# EasyEDA Pro project CH32LoongsonEJTAG_v1.2.epro

# Schematic Schematic1
Board Name: Board1; Create Date: 2025-04-06; Page Name: P1; Project Name: CH32LoongsonEJTAG; Schematic Name: Schematic1; Update Date: 2025-05-27; Company: 嘉立创EDA; Page Size: A4; Version: V1.1
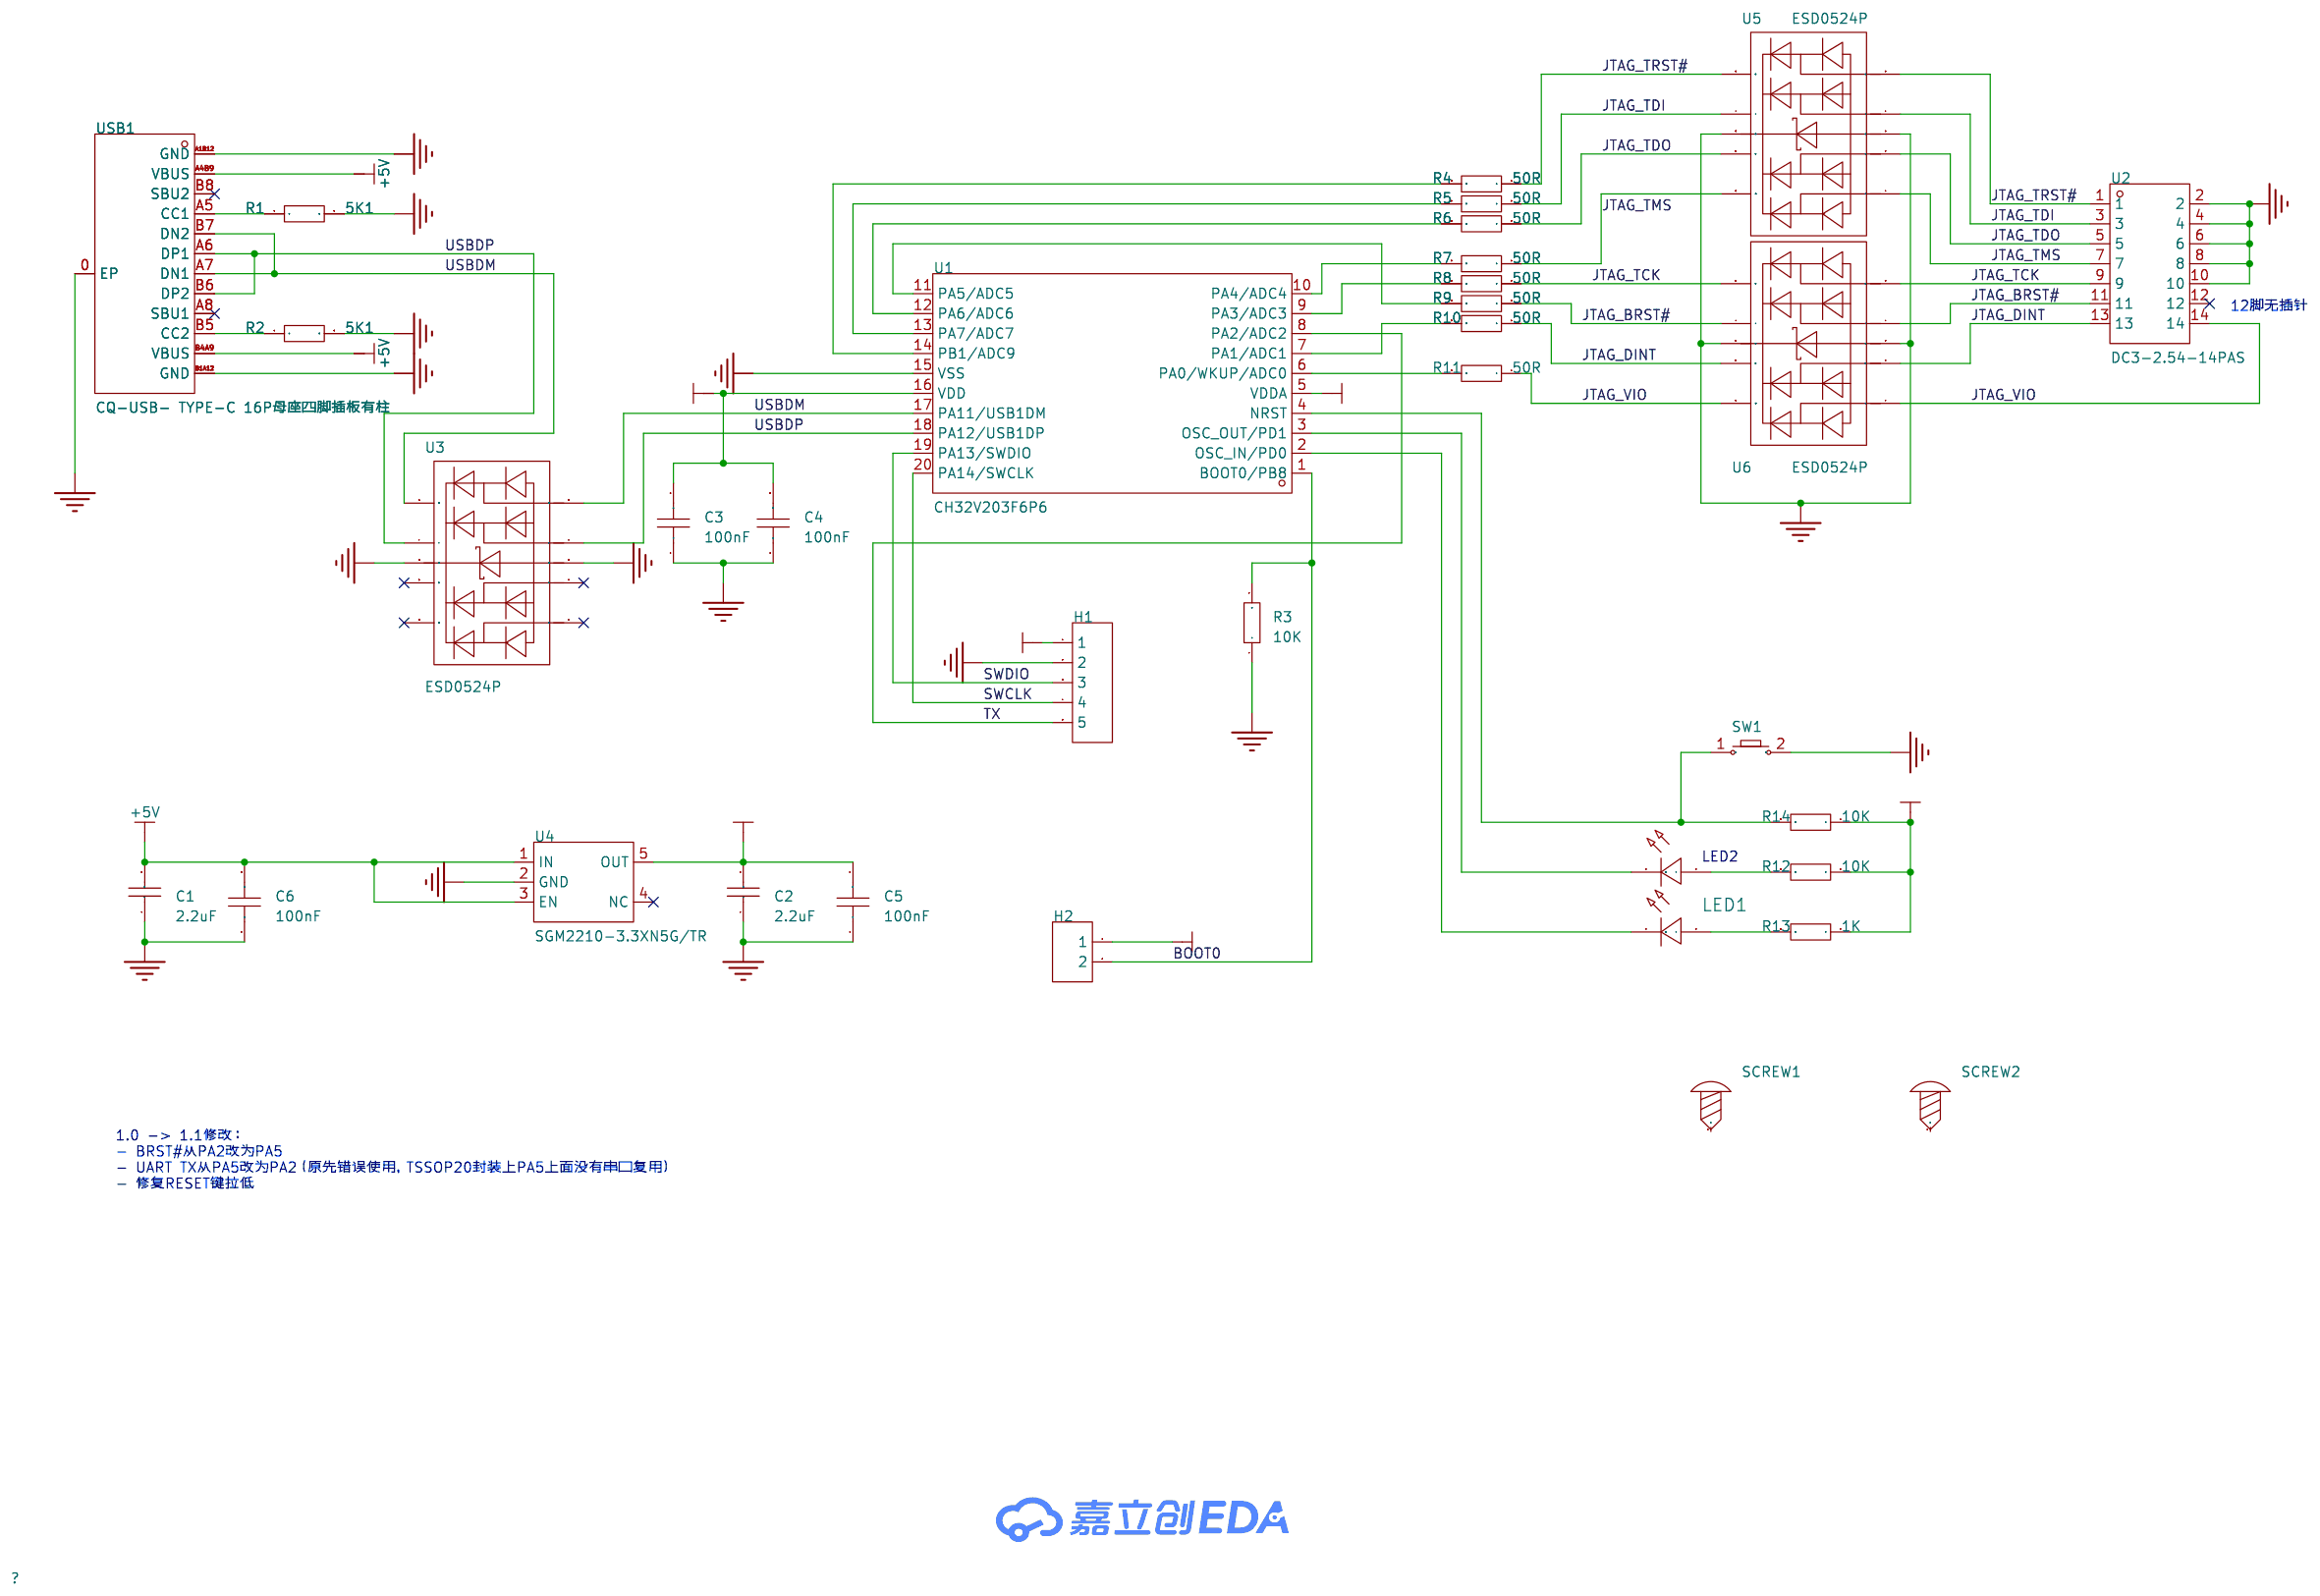
[diagram p0: schematic sheet]

## Parts
C1  2.2uF  [C0603]
C2  2.2uF  [C0603]
C3  100nF  [C0603]
C4  100nF  [C0603]
C5  100nF  [C0603]
C6  100nF  [C0603]
H1  -  [HDR-TH_5P-P2.54-V-F]
H2  -  [HDR-TH_2P-P2.54-V-F]
LED1  -  [LED_0603]
LED2  -  [LED_0603]
R1  5K1  [R0603]
R2  5K1  [R0603]
R3  10K  [R0603]
R4  50R  [R0603]
R5  50R  [R0603]
R6  50R  [R0603]
R7  50R  [R0603]
R8  50R  [R0603]
R9  50R  [R0603]
R10  50R  [R0603]
R11  50R  [R0603]
R12  10K  [R0603]
R13  1K  [R0603]
R14  10K  [R0603]
SCREW1  -  [M2螺丝]
SCREW2  -  [M2螺丝]
SW1  -  [Key_SMD_3x4x2]
U1  CH32V203F6P6  [TSSOP-20_L6.5-W4.4-P0.65-LS6.4-BL]
U2  DC3-2.54-14PAS  [IDC-TH_14P-P2.54_DC3-2.54-14PAS]
U3  ESD0524P  [DFN-10_L2.5-W1.0-P0.50-BL-A]
U4  SGM2210-3.3XN5G/TR  [SOT-23-5_L2.9-W1.6-P0.95-LS2.8-BL]
U5  ESD0524P  [DFN-10_L2.5-W1.0-P0.50-BL-A]
U6  ESD0524P  [DFN-10_L2.5-W1.0-P0.50-BL-A]
USB1  CQ-USB- TYPE-C 16P母座四脚插板有柱  [USB-C-SMD_CQ-USB-TYPE-C]

## Library data of the parts
C1 C2 = 0603B222K500NT: 容值:2.2nF;精度:±10%;额定电压:50V;温度系数:X7R;; LCSC Part Name: 2.2nF ±10% 50V; Supplier Part: C1604; Manufacturer: FH(风华); Supplier Footprint: 0603; JLCPCB Part Class: Basic Part; Datasheet: https://atta.szlcsc.com/upload/public/pdf/source/20200305/C486355_26A10D38EF8C2A5C37091D0039909270.pdf; Supplier: LCSC; Tolerance: ±10%; Voltage Rating: 50V; Temperature Coefficient: X7R
C3-C6 = CC0603KRX7R9BB104: 容值:100nF;精度:±10%;额定电压:50V;材质(温度系数):X7R;; LCSC Part Name: 100nF ±10% 50V; Supplier Part: C14663; Manufacturer: YAGEO(国巨); Supplier Footprint: 0603; JLCPCB Part Class: 基础库; Datasheet: https://atta.szlcsc.com/upload/public/pdf/source/20180910/C282072_33301C7F631E79921B82A8DAC6BCC5B3.pdf; Supplier: LCSC; Tolerance: ±10%; Voltage Rated: 50V; Temperature Coefficient: X7R
H1 = HDR-F_2.54_1x5P: Supplier Part: C50950; Supplier Footprint: 插件
H2 = HDR-F_2.54_1x2P: Supplier Part: C49661; Supplier Footprint: 插件
LED1 = LED_0603-R: Supplier Footprint: 0603
LED2 = LED_0603-G: Supplier Footprint: 0603
R1-R14 = Res_0603: Supplier Footprint: 0603
SCREW1 SCREW2 = M2螺丝: Supplier Footprint: 插件
SW1 = Key_SMD_3x4x2: Supplier Footprint: SMD
U1 = CH32V203F6P6: Supplier Part: C3040880; Manufacturer: WCH(南京沁恒); Supplier Footprint: TSSOP-20; JLCPCB Part Class: 扩展库; Datasheet: https://atta.szlcsc.com/upload/public/pdf/source/20230523/1B381532B53560847D0152FAE396CF1C.pdf; Supplier: LCSC
U2 = DC3-2.54-14PAS: 连接器类型:简牛座;间距:2.54mm;结构:2x7P;额定电流:1.5A;额定电压:-;封装形式:直插;行距:2.54mm;排数:2;每排PIN数:7;工作温度范围:-40℃~+105℃;; LCSC Part Name: 2.54mm 2x7P 排数:2 每排P数:7; Supplier Part: C2977595; Manufacturer: ZHOURI(洲日); Supplier Footprint: 插件,P=2.54mm; JLCPCB Part Class: 扩展库; Datasheet: https://atta.szlcsc.com/upload/public/pdf/source/20220328/8C4F9C608F6421C8730FC92148E2CB6E.pdf; Supplier: LCSC; Connector Type: 简牛座; Pitch: 2.54mm; Structure: 2x7P; Current Rating (Max): 1.5A; Holder Type: 直插; Row Spacing: 2.54mm; Number of Rows: 2; Pin Number in each Row: 7; Operating Temperature Range: -40℃~+105℃
U3 U5 U6 = ESD0524P_C5334573: 极性:单向;反向截止电压(Vrwm):5V;最大钳位电压:15V;峰值脉冲电流(Ipp)@10/1000us:2A;峰值脉冲功率(Ppp)@10/1000us:-;击穿电压:6V;; Supplier Part: C5334573; Manufacturer: SHIKUES(时科); Supplier Footprint: DFN2510; JLCPCB Part Class: 扩展库; Datasheet: https://atta.szlcsc.com/upload/public/pdf/source/20230209/B8924CF75EEDB5BA3DE32DF217AD14E8.pdf; Supplier: LCSC; polarity: 单向; Reverse Stand-Off Voltage (Vrwm): 5V; Maximum Clamping Voltage: 15V; Peak Pulse Current (Ipp)@10/1000us: 2A; Breakdown Voltage: 6V; Reverse Leakage Current (Ir): 1uA; Number of Lines: 四路; Operating Temperature: -55℃~+150℃; Type: ESD
U4 = SGM2210-3.3XN5G/TR: 输出类型:固定;工作电压:20V;输出电压:3.3V;输出电流:300mA;电源纹波抑制比(PSRR):100dB@(1kHz);输出极性:正极;; Supplier Part: C5151474; Manufacturer: SGMICRO(圣邦微); Supplier Footprint: SOT-23-5; JLCPCB Part Class: 扩展库; Datasheet: https://atta.szlcsc.com/upload/public/pdf/source/20220928/808BA7917380B7C92775D16A10930CC7.pdf; Supplier: LCSC; Output Type: 固定; Voltage - Supply: 20V; Output Voltage: 3.3V; Output Current: 300mA; Power Supply Rejection Ratio (PSRR): 100dB@(1kHz); Features: 防静电保护；短路保护(SCP)；低ESR；热关断(TSD)；过流保护(OCP)；带使能；防倒灌; Operating Temperature: -40℃~+125℃@(Tj); Output Configuration: 正极; Number of Outputs: 1
USB1 = CQ-USB- TYPE-C 16P母座四脚插板有柱: Supplier Part: C9900026759; Supplier Footprint: USB-TYPE-C-SMD-16P; JLCPCB Part Class: 扩展库; Supplier: LCSC

## Nets
+3V3: C2.2 C3.2 C4.2 C5.2 H1.1 H2.1 R12.1 R13.1 R14.1 U1.5(VDDA) U1.16(VDD) U4.5(OUT)
+5V: C1.2 C6.2 U4.1(IN) U4.3(EN) USB1.A4B9(VBUS) USB1.B4A9(VBUS)
GND: C1.1 C2.1 C3.1 C4.1 C5.1 C6.1 H1.2 R1.2 R2.2 R3.1 SW1.2 U1.15(VSS) U2.2 U2.4 U2.6 U2.8 U2.10 U3.3 U3.8 U4.2(GND) U5.3 U5.8 U6.3 U6.8 USB1.0(EP) USB1.A1B12(GND) USB1.B1A12(GND)
BOOT0: H2.2 R3.2 U1.1(BOOT0/PB8)
JTAG_BRST#: R9.1 U2.11 U6.4 U6.7
JTAG_DINT: R10.1 U2.13 U6.2 U6.9
JTAG_TCK: R8.1 U2.9 U6.5 U6.6
JTAG_TDI: R5.1 U2.3 U5.4 U5.7
JTAG_TDO: R6.1 U2.5 U5.2 U5.9
JTAG_TMS: R7.1 U2.7 U5.1 U5.10
JTAG_TRST#: R4.1 U2.1 U5.5 U5.6
JTAG_VIO: R11.1 U2.14 U6.1 U6.10
SWCLK: H1.4 U1.20(PA14/SWCLK)
SWDIO: H1.3 U1.19(PA13/SWDIO)
TX: H1.5 U1.8(PA2/ADC2)
USBDM: U1.17(PA11/USB1DM) U3.5 U3.6 USB1.A7(DN1) USB1.B7(DN2)
USBDP: U1.18(PA12/USB1DP) U3.4 U3.7 USB1.A6(DP1) USB1.B6(DP2)
$1N687: R2.1 USB1.B5(CC2)
$1N691: R1.1 USB1.A5(CC1)
$1N2542: LED2.2(A) R12.2
$1N2581: LED2.1(C) U1.3(OSC_OUT/PD1)
$1N3114: R11.2 U1.6(PA0/WKUP/ADC0)
$1N3123: R10.2 U1.7(PA1/ADC1)
$1N3142: R8.2 U1.9(PA3/ADC3)
$1N3149: R7.2 U1.10(PA4/ADC4)
$1N3156: R6.2 U1.12(PA6/ADC6)
$1N3163: R5.2 U1.13(PA7/ADC7)
$1N3170: R4.2 U1.14(PB1/ADC9)
$1N3368: R14.2 SW1.1 U1.4(NRST)
$1N3438: LED1.2(A) R13.2
$1N3440: LED1.1(C) U1.2(OSC_IN/PD0)
$1N6997: R9.2 U1.11(PA5/ADC5)

Not connected (* = marked no-connect by the designer): SCREW1 1; SCREW2 1; U2 12*; U3 1* 2* 9* 10*; U4 4(NC)*; USB1 A8(SBU1)* B8(SBU2)*

## Notes on the sheet
- 12脚无插针
- 1.0 -> 1.1修改：
  - BRST#从PA2改为PA5
  - UART TX从PA5改为PA2（原先错误使用，TSSOP20封装上PA5上面没有串口复用）
  - 修复RESET键拉低

# Board PCB1
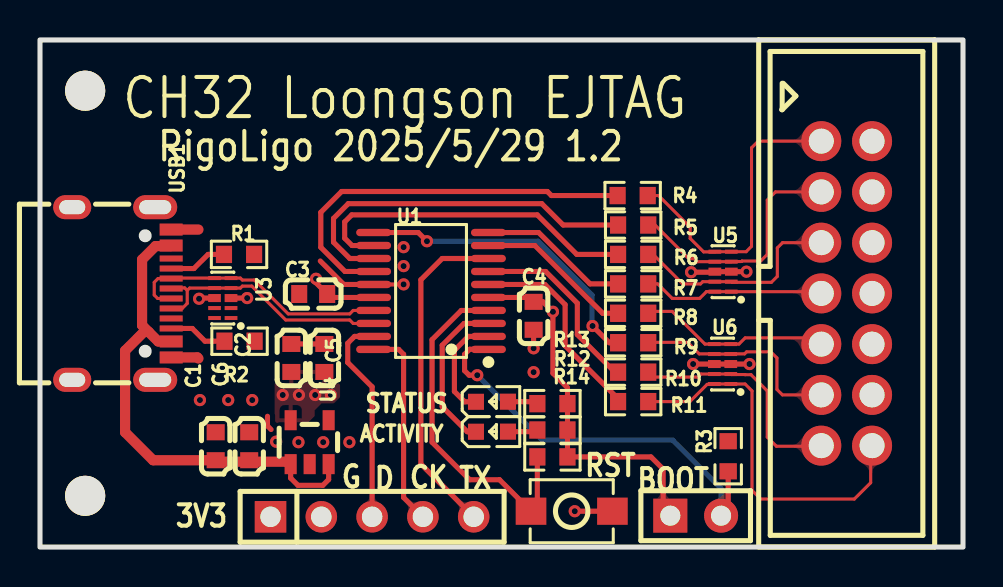
[diagram p1: board, top side]
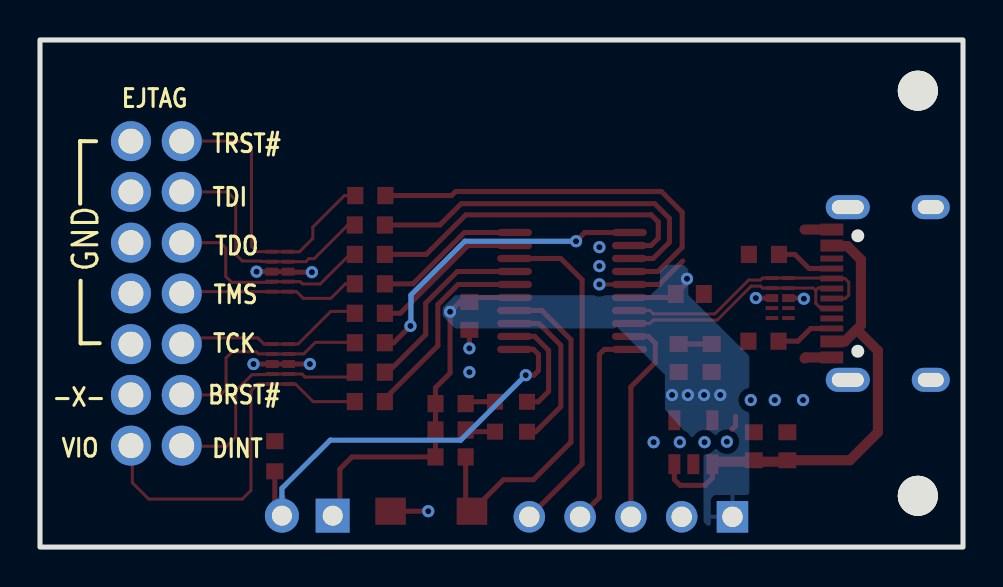
[diagram p2: board, bottom side, seen from below]

Outline 46.16 x 25.38 mm; copper layers: Top Layer, Bottom Layer. Coordinates in mm from the lower left corner of the outline.
Outline path: rectangle 0,25.38 46.16,0
Stack: Top Layer 0.035mm / Dielectric1 1.51mm FR4 er 4.5 / Bottom Layer 0.035mm

## Design rules (mm)
net USBDP: DP2
net USBDM: DP2
template: 自定义配置
spacing copperThickness1oz (default): track to track 0.102, other pairs 0.152 to 0.3
spacing copperThickness2oz: track to track 0.203, other pairs 0.152 to 0.3
track width copperThickness1oz (default): min 0.127, default 0.254, max 2.54
track width copperThickness2oz: min 0.203, default 0.254, max 2.54
differential pair differentialPair (default): width min 0.127, default 0.254, max 2.54; gap min 0.152, default 0.152
via viaSize (default): diameter min 0.5, default 0.61, max 10; hole min 0.3, default 0.305, max 6.3

## Placement (name value [footprint] x y rotation side)
C1  2.2uF  [C0603]  8.79 5.04 270 top
C2  2.2uF  [C0603]  12.57 9.46 270 top
C3  100nF  [C0603]  13.66 12.66 0 top
C4  100nF  [C0603]  24.69 11.57 90 top
C5  100nF  [C0603]  14.22 9.46 270 top
C6  100nF  [C0603]  10.46 5.04 270 top
H1  -  [HDR-TH_5P-P2.54-V-F]  16.61 1.51 0 top
H2  -  [HDR-TH_2P-P2.54-V-F]  32.79 1.57 0 top
LED1  -  [LED_0603]  22.65 7.28 0 top
LED2  -  [LED_0603]  22.65 5.78 0 top
R1  5K1  [R0603]  9.95 14.65 0 top
R2  5K1  [R0603]  9.98 10.3 0 top
R3  10K  [R0603]  34.42 4.54 270 top
R4  50R  [R0603]  29.64 17.59 180 top
R5  50R  [R0603]  29.66 16.12 180 top
R6  50R  [R0603]  29.66 14.65 180 top
R7  50R  [R0603]  29.66 13.17 180 top
R8  50R  [R0603]  29.66 11.7 180 top
R9  50R  [R0603]  29.66 10.23 180 top
R10  50R  [R0603]  29.66 8.75 180 top
R11  50R  [R0603]  29.66 7.28 180 top
R12  10K  [R0603]  25.63 5.86 180 top
R13  1K  [R0603]  25.63 7.18 180 top
R14  10K  [R0603]  25.63 4.51 180 top
SCREW1  -  [M2螺丝]  2.26 22.84 0 top
SCREW2  -  [M2螺丝]  2.26 2.56 0 top
SW1  -  [Key_SMD_3x4x2]  26.59 1.79 0 top
U1  CH32V203F6P6  [TSSOP-20_L6.5-W4.4-P0.65-LS6.4-BL]  19.55 12.82 90 top
U2  DC3-2.54-14PAS  [IDC-TH_14P-P2.54_DC3-2.54-14PAS]  40.34 12.7 270 top
U3  ESD0524P  [DFN-10_L2.5-W1.0-P0.50-BL-A]  9.14 12.46 90 top
U4  SGM2210-3.3XN5G/TR  [SOT-23-5_L2.9-W1.6-P0.95-LS2.8-BL]  13.48 5.25 0 top
U5  ESD0524P  [DFN-10_L2.5-W1.0-P0.50-BL-A]  34.16 13.78 90 top
U6  ESD0524P  [DFN-10_L2.5-W1.0-P0.50-BL-A]  34.13 9.16 90 top
USB1  CQ-USB- TYPE-C 16P母座四脚插板有柱  [USB-C-SMD_CQ-USB-TYPE-C]  4.09 12.69 270 top

## Footprints (pads in the part's own frame, mm; a bottom-side part is the same pattern mirrored in y, then rotated)
C0603
  rect 0.8x0.9 smd: 1(-0.7,0) 2(0.7,0)
DFN-10_L2.5-W1.0-P0.50-BL-A
  rect 0.2x0.633 smd: 1(-1,-0.411) 2(-0.5,-0.411) 4(0.5,-0.411) 5(1,-0.411) 6(1,0.411) 7(0.5,0.411) 9(-0.5,0.411) 10(-1,0.411)
  rect 0.4x0.633 smd: 3(0,-0.411) 8(0,0.411)
HDR-TH_2P-P2.54-V-F
  rect 1.7x1.7 hole 1: 1(-1.27,0)
  round 1.7 hole 1: 2(1.27,0)
HDR-TH_5P-P2.54-V-F
  rect 1.575x1.575 hole 1.02: 1(-5.08,0)
  round 1.575 hole 1.02: 2(-2.54,0) 3(0,0) 4(2.54,0) 5(5.08,0)
IDC-TH_14P-P2.54_DC3-2.54-14PAS
  round 2 hole 1.25: 1(-7.62,-1.27) 2(-7.62,1.27) 3(-5.08,-1.27) 4(-5.08,1.27) 5(-2.54,-1.27) 6(-2.54,1.27) 7(0,-1.27) 8(0,1.27) 9(2.54,-1.27) 10(2.54,1.27) 11(5.08,-1.27) 12(5.08,1.27) 13(7.62,-1.27) 14(7.62,1.27)
Key_SMD_3x4x2
  rect 1.53x1.36 smd: 1(-2.035,0) 2(2.035,0)
LED_0603
  rect 0.8x0.8 smd: 1(-0.851,-0.01) 2(0.75,-0.005)
M2螺丝
  round 2 hole 2: 1(0,0)
R0603
  rect 0.806x0.864 smd: 1(-0.753,0) 2(0.753,0)
SOT-23-5_L2.9-W1.6-P0.95-LS2.8-BL
  rect 0.6x1 smd: 1(-0.95,-1.1) 2(0,-1.1) 3(0.95,-1.1) 4(0.95,1.1) 5(-0.95,1.1)
TSSOP-20_L6.5-W4.4-P0.65-LS6.4-BL
  oval 0.364x1.742 smd: 1(-2.925,-2.871) 2(-2.275,-2.871) 3(-1.625,-2.871) 4(-0.975,-2.871) 5(-0.325,-2.871) 6(0.325,-2.871) 7(0.975,-2.871) 8(1.625,-2.871) 9(2.275,-2.871) 10(2.925,-2.871) 11(2.925,2.871) 12(2.275,2.871) 13(1.625,2.871) 14(0.975,2.871) 15(0.325,2.871) 16(-0.325,2.871) 17(-0.975,2.871) 18(-1.625,2.871) 19(-2.275,2.871) 20(-2.925,2.871)
USB-C-SMD_CQ-USB-TYPE-C
  oval 1.2x2.2 hole 0.7x1.6: 0(-4.32,1.675) 0(4.32,1.675)
  oval 1.2x1.9 hole 0.7x1.3: 0(-4.32,-2.475) 0(4.32,-2.475)
  rect 0.6x1.15 smd: A1B12(-3.2,2.471) A4B9(-2.4,2.471) B1A12(3.2,2.475) B4A9(2.4,2.475)
  rect 0.3x1.15 smd: A5(-1.25,2.475) A6(-0.25,2.475) A7(0.25,2.474) A8(1.25,2.475) B5(1.75,2.475) B6(0.75,2.475) B7(-0.75,2.473) B8(-1.75,2.475)

## Nets
As in the schematic.

Pads without a net: SCREW1 1; SCREW2 1; U2 12; U3 1 2 9 10; U4 4; USB1 A8 B8

## Via types
v1: diameter 0.61, hole 0.305, Top Layer to Bottom Layer, 28 vias

## Routing (per net, layer and track width the routed paths; a pad name or vN(x,y) marks a point on that pad's centre or on a via; arc(x,y) is an arc through that point)
+3V3: length 22
  Top Layer w0.254: U1.5 24.47,12.49 C4.2 25.15,12.27 v1(25.65,11.78) 25.65,8.7 26.38,7.97 R13.1 R12.1 R14.1 30.55,4.51 31.16,3.9 31.16,1.93 31.52,1.57 ; v1(13.8,13.43) 13.8,13.22 C3.2 14.53,12.49 U1.16
  Top Layer w0.508: 12.53,6.35 12.53,6.36
  vias: v1(12.14,7.61) v1(12.95,7.61) v1(13.76,7.61) v1(14.55,7.61)
+5V: length 25.1
  Top Layer w0.254: 12.53,4.15 12.53,3.45 12.9,3.09 14.14,3.09 14.43,3.38 U4.3
  Top Layer w0.508: 12.53,4.15 12.48,4.15 12.36,4.27 8.86,4.27 C1.2 5.65,4.34 4.26,5.74 4.26,9.83 5.2,10.77 5.43,10.77 ; USB1.B4A9 5.91,10.29 5.43,10.77 ; USB1.A4B9 6.53,15.06 5.78,15.06 5.1,14.39 5.1,11.1 5.43,10.77
GND: length 19.8
  Top Layer w0.203: U1.15 18.18,13.14 v1(18.18,13.15)
  Top Layer w0.254: 11.55,5.88 11.38,6.06 11.38,6.54 ; v1(32.66,9.16) U6.8 U6.3 v1(35.48,9.16) ; U3.8 7.92,12.46 ; v1(26.74,1.79) SW1.2 ; C5.1 C2.1 ; v1(35.33,13.78) U5.3 U5.8 33.72,13.76 v1(32.56,13.76) ; U1.15 15.19,13.14 14.02,14.32 ; v1(24.69,9.95) C4.1 ; U3.3 v1(10.36,12.46)
  Top Layer w0.508: 7.92,9.44 7.87,9.49 USB1.B1A12 ; USB1.A1B12 7.92,15.89
  vias: v1(7.96,12.43) v1(8,7.36) v1(9.41,7.36) v1(10.61,7.36) v1(11.81,5.27) v1(12.93,5.25) v1(14.16,5.25) v1(15.47,5.25) v1(18.18,15.01) v1(18.18,14.06) v1(24.69,8.75)
BOOT0: length 21.1
  Top Layer w0.254: U1.1 22.02,9.89 22.01,9.9 21.49,9.9 21.23,9.64 21.23,8.83 21.46,8.6 v1(21.87,8.6) ; R3.2 34.42,1.92 H2.2
  Bottom Layer w0.254: H2.2 34.06,2.93 31.65,5.35 25.12,5.35 v1(21.87,8.6)
JTAG_BRST#: length 10.8
  Top Layer w0.152: R9.1 30.44,10.25 32.39,10.25 32.97,9.67 33.71,9.67 U6.7 U6.4 34.57,9.66 34.58,9.67 35.23,9.67 35.34,9.77 36.55,9.77 36.85,9.46 36.85,7.89 37.13,7.62 U2.11
JTAG_DINT: length 11.7
  Top Layer w0.152: R10.1 30.66,8.51 32.9,8.51 33.06,8.66 U6.9 U6.2 34.57,8.63 35.25,8.63 35.26,8.63 35.56,8.63 36.37,7.81 36.37,5.5 36.83,5.04 39.04,5.04 U2.13
JTAG_TCK: length 9.6
  Top Layer w0.152: U2.9 38.76,10.47 35.27,10.47 34.95,10.16 U6.5 U6.6 33.25,10.16 31.62,11.8 30.51,11.8 R8.1
JTAG_TDI: length 12.5
  Top Layer w0.152: R5.1 30.76,16.12 32.44,14.43 32.71,14.43 32.86,14.28 U5.7 U5.4 34.58,14.29 35.08,14.29 35.11,14.32 36.04,14.32 36.37,14.65 36.37,17.36 36.78,17.78 U2.3
JTAG_TDO: length 11
  Top Layer w0.152: U2.5 37.14,15.23 36.87,14.97 36.87,13.55 36.57,13.25 34.6,13.25 U5.2 U5.9 33.14,13.28 33.03,13.17 32.14,13.17 30.66,14.65 R6.1
JTAG_TMS: length 9.1
  Top Layer w0.152: R7.1 30.89,13.17 31.62,12.45 32.99,12.45 33.33,12.78 U5.10 U5.1 38.98,12.78 U2.7
JTAG_TRST#: length 15.4
  Top Layer w0.152: U2.1 35.92,20.32 35.58,19.98 35.58,15.05 35.31,14.78 U5.5 U5.6 33.74,14.77 33.19,14.77 32.52,15.45 32.52,16.01 30.93,17.59 R4.1
JTAG_VIO: length 19
  Top Layer w0.152: R11.1 32.5,7.28 33.36,8.14 33.71,8.14 U6.10 U6.1 35.26,8.16 35.61,7.81 35.61,2.84 36.04,2.4 40.72,2.4 41.54,3.22 41.54,5.01 U2.14
SWCLK: length 10.1
  Top Layer w0.254: U1.20 17.93,9.89 18.18,9.64 18.18,2.48 H1.4
SWDIO: length 10.6
  Top Layer w0.254: U1.19 15.73,10.54 15.39,10.2 15.39,9.24 16.61,8.02 H1.3
TX: length 16.8
  Top Layer w0.254: H1.5 19.05,4.16 19.05,13.38 20.11,14.44 U1.8
USBDM: length 13.4
  Top Layer w0.152: U1.17 15.66,11.84 15.49,11.67 12.41,11.67 10.72,13.36 10.12,13.36 10.02,13.46 U3.5 U3.6 6.58,13.46 USB1.B7 5.9,13.44 5.71,13.25 5.71,12.61 5.89,12.44 USB1.A7
USBDP: length 12.6
  Top Layer w0.152: U1.18 15.66,11.19 15.49,11.36 12.29,11.36 10.59,13.06 10.12,13.06 10.02,12.96 U3.4 U3.7 7.48,12.96 7.36,12.84 ; 7.36,12.84 7.36,12.2 7.11,11.94 USB1.B6 ; 7.36,12.84 7.24,12.97 6.59,12.97 USB1.A6
$1N687: length 2.9
  Top Layer w0.254: R2.1 8.25,10.3 7.61,10.94 USB1.B5
$1N691: length 2.9
  Top Layer w0.254: 9.2,14.65 8.4,14.65 7.7,13.94 USB1.A5
$1N2542: length 1.5
  Top Layer w0.254: R12.2 24.79,5.78 LED2.2
$1N2581: length 8
  Top Layer w0.254: 21.8,5.77 21.37,5.77 20.11,7.03 20.11,10.1 21.21,11.19 U1.3
$1N3114: length 10.2
  Top Layer w0.254: U1.6 25.25,13.14 26.26,12.13 26.26,10.07 28.91,7.42 R11.2
$1N3123: length 9.5
  Top Layer w0.254: U1.7 25.29,13.79 26.87,12.21 26.87,10.63 28.75,8.75 R10.2
$1N3142: length 7.9
  Top Layer w0.254: U1.9 24.75,15.09 28.14,11.7 R8.2
$1N3149: length 7.5
  Top Layer w0.254: R7.2 27.51,13.17 24.94,15.74 U1.10
$1N3156: length 17.1
  Top Layer w0.254: R6.2 26.84,14.65 24.86,16.63 15.59,16.63 15.24,16.27 15.24,15.46 15.6,15.09 U1.12
$1N3163: length 18.5
  Top Layer w0.254: R5.2 26.16,16.12 25.09,17.19 15.41,17.19 14.68,16.45 14.68,15.26 15.49,14.44 U1.13
$1N3170: length 20.3
  Top Layer w0.254: U1.14 15.25,13.79 14.04,15 14.04,16.75 15.08,17.8 25.37,17.8 25.57,17.59 R4.2
$1N3368: length 17.8
  Top Layer w0.254: R14.2 24.87,2.11 SW1.1 22.98,3.37 21.49,3.37 19.61,5.25 19.61,10.38 21.07,11.84 U1.4
$1N3438: length 1.5
  Top Layer w0.254: R13.2 24.78,7.27 23.4,7.27
$1N3440: length 5.3
  Top Layer w0.254: U1.2 21.42,10.54 20.72,9.85 20.72,7.79 21.24,7.27 21.8,7.27
$1N6997: length 15.4
  Top Layer w0.254: U1.11 18.92,15.74 v1(19.35,15.31) ; v1(27.63,11.06) 28.47,10.23 R9.2
  Bottom Layer w0.254: v1(19.35,15.31) 24.91,15.31 27.61,12.61 27.61,11.09 v1(27.63,11.06)

## Copper pours and planes (outline as drawn; the poured copper is in the pictures)
+3V3 on Top Layer: 11.81,6.21 11.73,6.29 11.73,8.96 12.01,9.24 14.7,9.24 15.01,8.93 15.01,7.5 14.7,7.19 14.08,7.19 13.74,6.85 13.74,6.56 13.39,6.21
+3V3 on Bottom Layer: 10.64,0.69 10.64,9.59 13.69,12.64 13.69,13.91 13.95,14.18 14.81,14.18 15.2,13.79 15.2,13.11 15.65,12.65 25.42,12.65 26.01,12.06 26.07,12.06 26.07,11.55 25.42,10.89 17.39,10.89 17.32,10.96 14.96,8.6 14.96,6.86 13.03,4.73 13.03,1.25 12.47,0.69 10.64,0.69
GND on Top Layer: -2.01,27.62 49.55,27.62 49.55,-2.22 -2.01,-2.22
GND on Bottom Layer: -5.52,29.94 52.17,29.94 52.17,-6.21 -5.52,-6.21

Small or netless copper shapes (teardrops, artwork), in the pictures only: 13 on Top Layer, 1 on Bottom Layer

## Text on the board
Bottom Silkscreen Layer: TDO | TMS | TCK | TDI | TRST# | DINT | BRST# | EJTAG | VIO | -X- | GND
Top Silkscreen Layer: ACTIVITY | STATUS | 3V3 | G | D | CK | TX | RST | BOOT | RigoLigo 2025/5/29 1.2 | CH32 Loongson EJTAG
